# Altium schematic sheet 10 AM572x Interface 1.SchDoc
size 420 x 297 mm
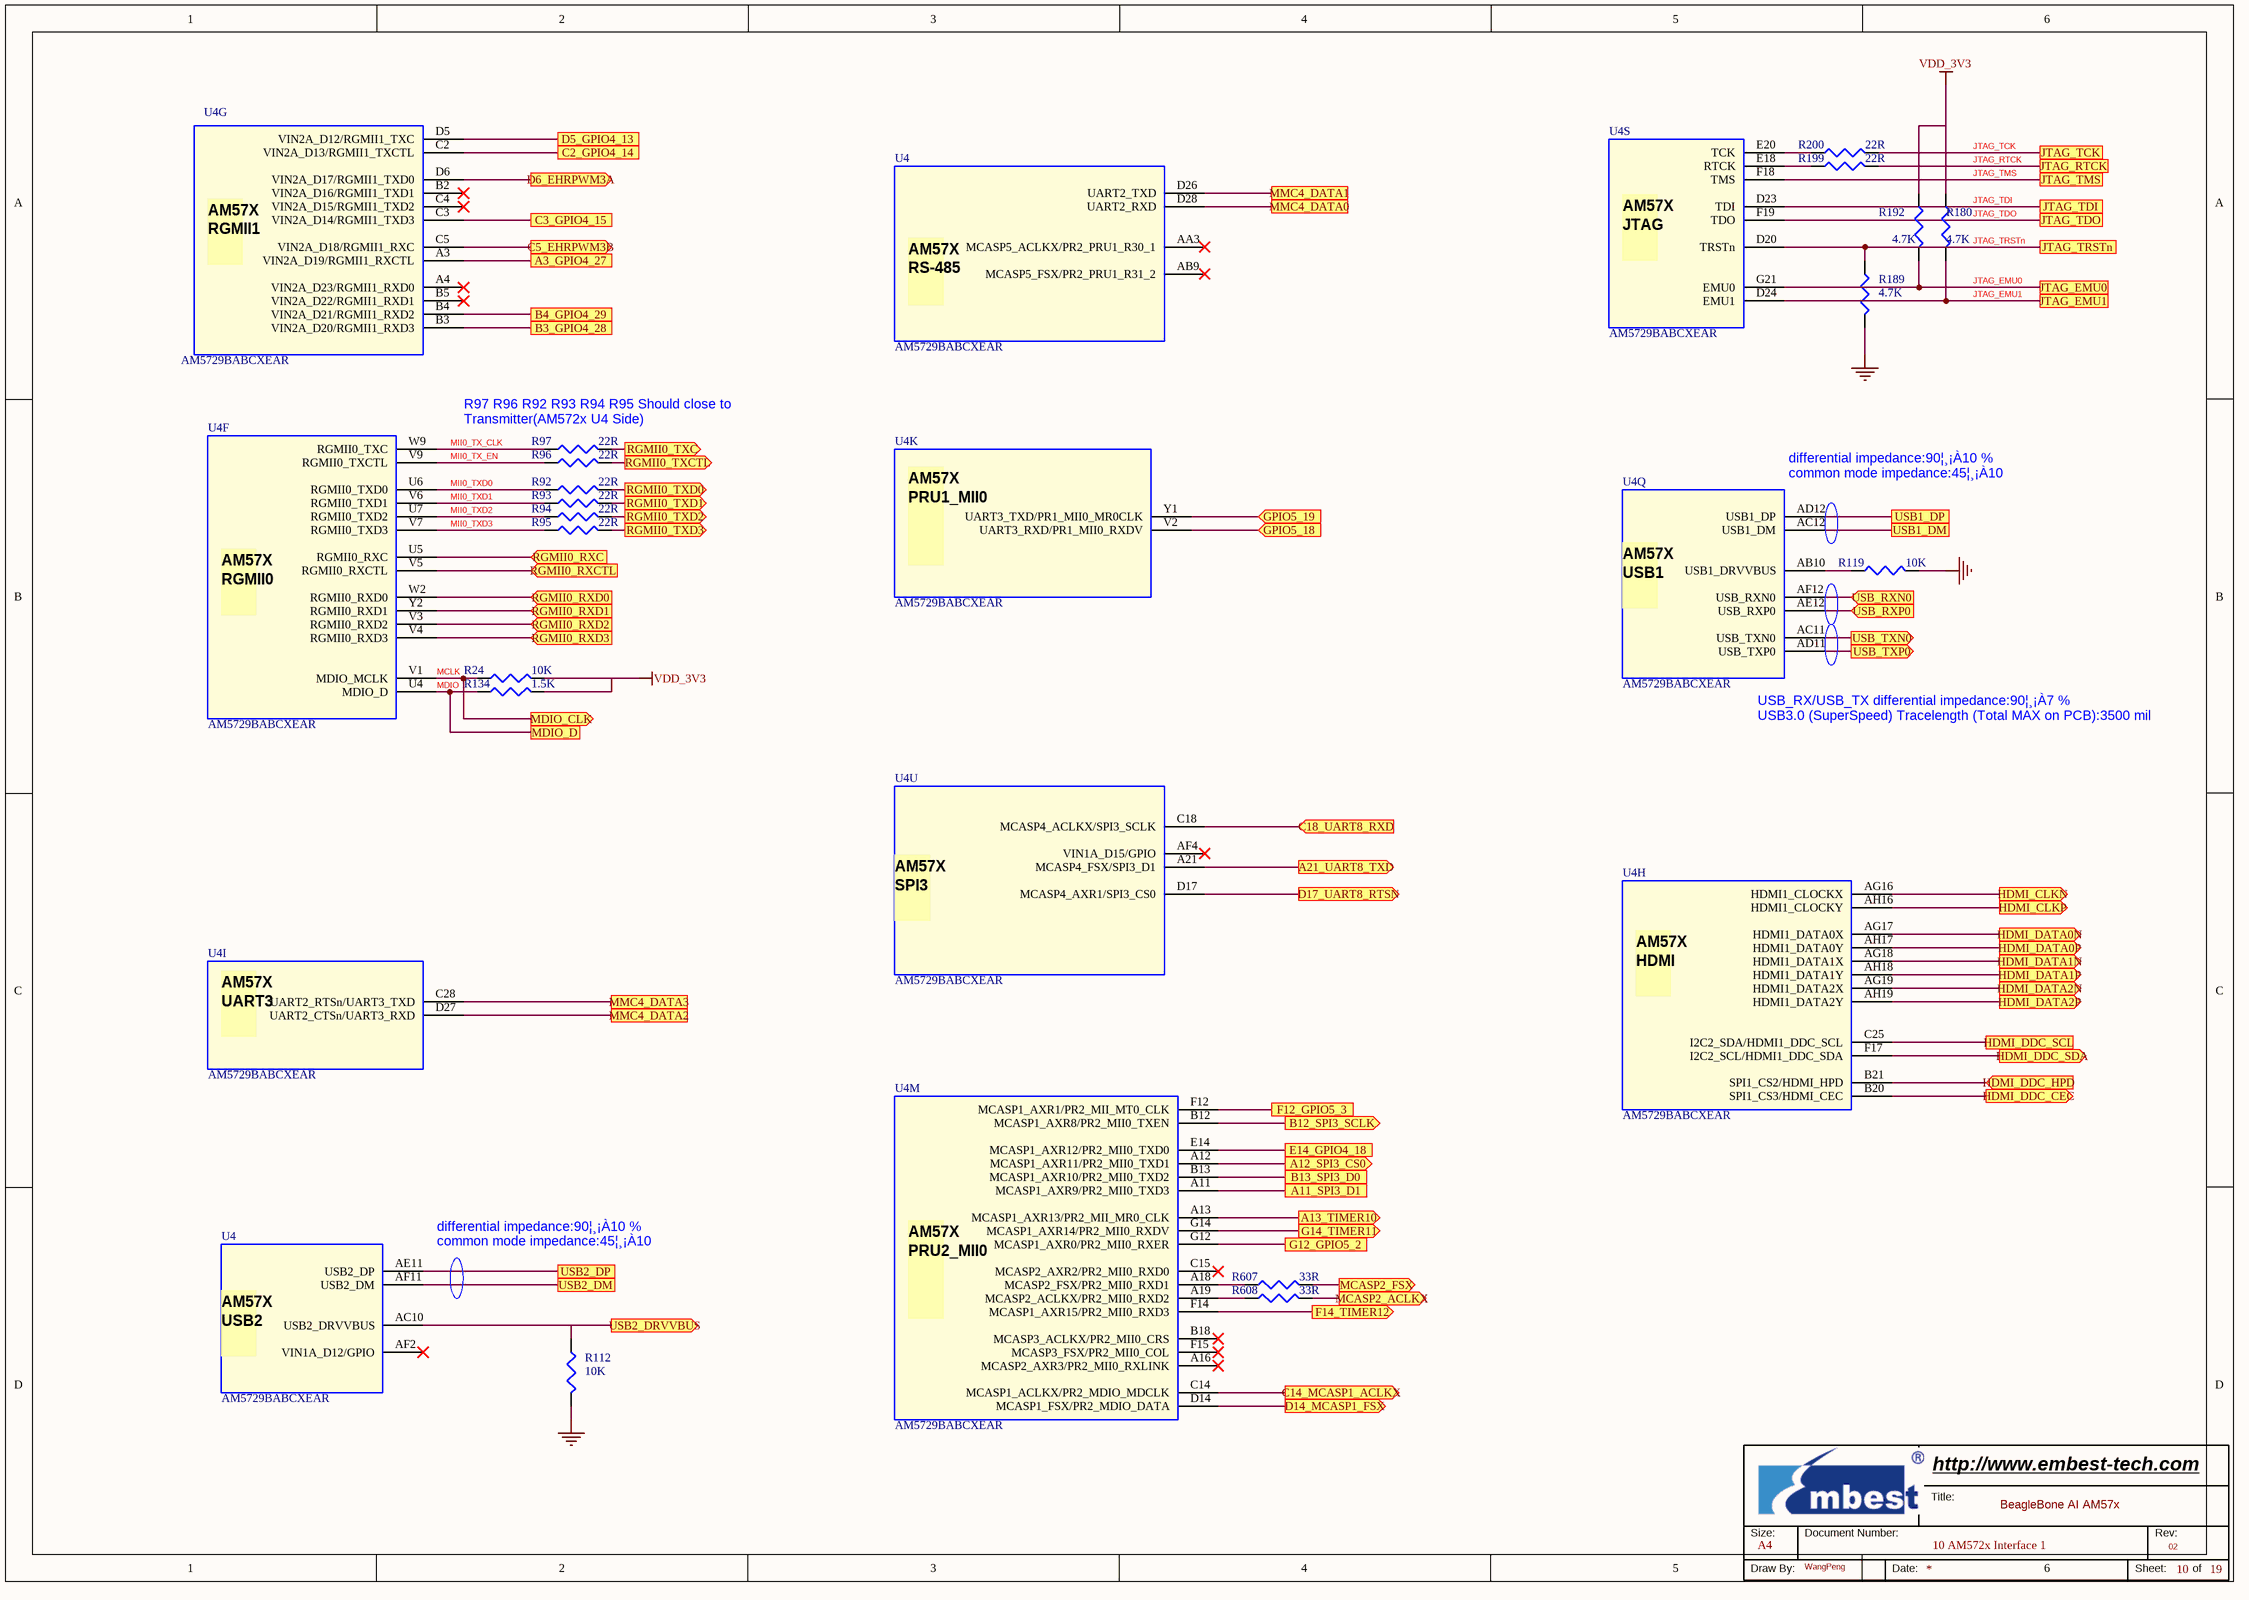
[diagram p0: 10 AM572x Interface 1.SchDoc]

## Parts
*  Page Count: 19  Page Number: 10  Page Size: A4  Title: BeagleBone AI AM57x  RevCode: 02  Doc: 10 AM572x Interface 1  Drawing: WangPeng  (hidden comment: Embest Title)  (graphical)
R24  10K  [R0402]
R92  22R  [R0402]
R93  22R  [R0402]
R94  22R  [R0402]
R95  22R  [R0402]
R96  22R  [R0402]
R97  22R  [R0402]
R112  10K  [R0402]
R119  10K  [R0402]
R134  1.5K  [R0402]
R180  4.7K  [R0402]
R189  4.7K  [R0402]
R192  4.7K  [R0402]
R199  22R  [R0402]
R200  22R  [R0402]
R607  33R  [R0402]
R608  33R  [R0402]
U4  AM5729BABCXEAR  [BGA23X23-760-117M]  (parts F,G,H,I,K,M,Q,S,U,27,29 of 29)

## Ports
A3_GPIO4_27, A11_SPI3_D1, A12_SPI3_CS0 (out), A13_TIMER10 (out), A21_UART8_TXD (out), B3_GPIO4_28, B4_GPIO4_29, B12_SPI3_SCLK (out), B13_SPI3_D0, C2_GPIO4_14, C3_GPIO4_15, C5_EHRPWM3B (out), C14_MCASP1_ACLKX (out), C18_UART8_RXD (in), D5_GPIO4_13, D6_EHRPWM3A (out), D14_MCASP1_FSX (out), D17_UART8_RTSN (out), E14_GPIO4_18, F12_GPIO5_3, F14_TIMER12 (out), G12_GPIO5_2, G14_TIMER11 (out), GPIO5_18 (in), GPIO5_19 (in), HDMI_CLKN (out), HDMI_CLKP (out), HDMI_DATA0N (out), HDMI_DATA0P (out), HDMI_DATA1N (out), HDMI_DATA1P (out), HDMI_DATA2N (out), HDMI_DATA2P (out), HDMI_DDC_CEC (out), HDMI_DDC_HPD (in), HDMI_DDC_SCL, HDMI_DDC_SDA (out), JTAG_EMU0, JTAG_EMU1, JTAG_RTCK, JTAG_TCK, JTAG_TDI, JTAG_TDO, JTAG_TMS, JTAG_TRSTn, MCASP2_ACLKX (out), MCASP2_FSX (out), MDIO_CLK (out), MDIO_D, MMC4_DATA0, MMC4_DATA1, MMC4_DATA2, MMC4_DATA3, RGMII0_RXC (in), RGMII0_RXCTL (in), RGMII0_RXD0 (in), RGMII0_RXD1 (in), RGMII0_RXD2 (in), RGMII0_RXD3 (in), RGMII0_TXC (out), RGMII0_TXCTL (out), RGMII0_TXD0 (out), RGMII0_TXD1 (out), RGMII0_TXD2 (out), RGMII0_TXD3 (out), USB1_DM, USB1_DP, USB2_DM, USB2_DP, USB2_DRVVBUS (out), USB_RXN0 (in), USB_RXP0 (in), USB_TXN0 (out), USB_TXP0 (out)

## Nets
GND: R112.2 R119.2 R189.2
VDD_3V3: R24.2 R134.2 R180.1 R192.1
A3_GPIO4_27: U4.A3(VIN2A_D19/RGMII1_RXCTL) ; port A3_GPIO4_27
A11_SPI3_D1: U4.A11(MCASP1_AXR9/PR2_MII0_TXD3) ; port A11_SPI3_D1
A12_SPI3_CS0: U4.A12(MCASP1_AXR11/PR2_MII0_TXD1) ; port A12_SPI3_CS0
A13_TIMER10: U4.A13(MCASP1_AXR13/PR2_MII_MR0_CLK) ; port A13_TIMER10
A21_UART8_TXD: U4.A21(MCASP4_FSX/SPI3_D1) ; port A21_UART8_TXD
B3_GPIO4_28: U4.B3(VIN2A_D20/RGMII1_RXD3) ; port B3_GPIO4_28
B4_GPIO4_29: U4.B4(VIN2A_D21/RGMII1_RXD2) ; port B4_GPIO4_29
B12_SPI3_SCLK: U4.B12(MCASP1_AXR8/PR2_MII0_TXEN) ; port B12_SPI3_SCLK
B13_SPI3_D0: U4.B13(MCASP1_AXR10/PR2_MII0_TXD2) ; port B13_SPI3_D0
C2_GPIO4_14: U4.C2(VIN2A_D13/RGMII1_TXCTL) ; port C2_GPIO4_14
C3_GPIO4_15: U4.C3(VIN2A_D14/RGMII1_TXD3) ; port C3_GPIO4_15
C5_EHRPWM3B: U4.C5(VIN2A_D18/RGMII1_RXC) ; port C5_EHRPWM3B
C14_MCASP1_ACLKX: U4.C14(MCASP1_ACLKX/PR2_MDIO_MDCLK) ; port C14_MCASP1_ACLKX
C18_UART8_RXD: U4.C18(MCASP4_ACLKX/SPI3_SCLK) ; port C18_UART8_RXD
D5_GPIO4_13: U4.D5(VIN2A_D12/RGMII1_TXC) ; port D5_GPIO4_13
D6_EHRPWM3A: U4.D6(VIN2A_D17/RGMII1_TXD0) ; port D6_EHRPWM3A
D14_MCASP1_FSX: U4.D14(MCASP1_FSX/PR2_MDIO_DATA) ; port D14_MCASP1_FSX
D17_UART8_RTSN: U4.D17(MCASP4_AXR1/SPI3_CS0) ; port D17_UART8_RTSN
E14_GPIO4_18: U4.E14(MCASP1_AXR12/PR2_MII0_TXD0) ; port E14_GPIO4_18
F12_GPIO5_3: U4.F12(MCASP1_AXR1/PR2_MII_MT0_CLK) ; port F12_GPIO5_3
F14_TIMER12: U4.F14(MCASP1_AXR15/PR2_MII0_RXD3) ; port F14_TIMER12
G12_GPIO5_2: U4.G12(MCASP1_AXR0/PR2_MII0_RXER) ; port G12_GPIO5_2
G14_TIMER11: U4.G14(MCASP1_AXR14/PR2_MII0_RXDV) ; port G14_TIMER11
GPIO5_18: U4.V2(UART3_RXD/PR1_MII0_RXDV) ; port GPIO5_18
GPIO5_19: U4.Y1(UART3_TXD/PR1_MII0_MR0CLK) ; port GPIO5_19
HDMI_CLKN: U4.AG16(HDMI1_CLOCKX) ; port HDMI_CLKN
HDMI_CLKP: U4.AH16(HDMI1_CLOCKY) ; port HDMI_CLKP
HDMI_DATA0N: U4.AG17(HDMI1_DATA0X) ; port HDMI_DATA0N
HDMI_DATA0P: U4.AH17(HDMI1_DATA0Y) ; port HDMI_DATA0P
HDMI_DATA1N: U4.AG18(HDMI1_DATA1X) ; port HDMI_DATA1N
HDMI_DATA1P: U4.AH18(HDMI1_DATA1Y) ; port HDMI_DATA1P
HDMI_DATA2N: U4.AG19(HDMI1_DATA2X) ; port HDMI_DATA2N
HDMI_DATA2P: U4.AH19(HDMI1_DATA2Y) ; port HDMI_DATA2P
HDMI_DDC_CEC: U4.B20(SPI1_CS3/HDMI_CEC) ; port HDMI_DDC_CEC
HDMI_DDC_HPD: U4.B21(SPI1_CS2/HDMI_HPD) ; port HDMI_DDC_HPD
HDMI_DDC_SCL: U4.C25(I2C2_SDA/HDMI1_DDC_SCL) ; port HDMI_DDC_SCL
HDMI_DDC_SDA: U4.F17(I2C2_SCL/HDMI1_DDC_SDA) ; port HDMI_DDC_SDA
JTAG_EMU0: R192.2 U4.G21(EMU0) ; port JTAG_EMU0
JTAG_EMU1: R180.2 U4.D24(EMU1) ; port JTAG_EMU1
JTAG_RTCK: R199.2 ; port JTAG_RTCK
JTAG_TCK: R200.2 ; port JTAG_TCK
JTAG_TDI: U4.D23(TDI) ; port JTAG_TDI
JTAG_TDO: U4.F19(TDO) ; port JTAG_TDO
JTAG_TMS: U4.F18(TMS) ; port JTAG_TMS
JTAG_TRSTn: R189.1 U4.D20(TRSTn) ; port JTAG_TRSTn
MCASP2_ACLKX: R608.2 ; port MCASP2_ACLKX
MCASP2_FSX: R607.2 ; port MCASP2_FSX
MCLK: R24.1 U4.V1(MDIO_MCLK) ; port MDIO_CLK
MDIO: R134.1 U4.U4(MDIO_D) ; port MDIO_D
MII0_TX_CLK: R97.1 U4.W9(RGMII0_TXC)
MII0_TX_EN: R96.1 U4.V9(RGMII0_TXCTL)
MII0_TXD0: R92.1 U4.U6(RGMII0_TXD0)
MII0_TXD1: R93.1 U4.V6(RGMII0_TXD1)
MII0_TXD2: R94.1 U4.U7(RGMII0_TXD2)
MII0_TXD3: R95.1 U4.V7(RGMII0_TXD3)
MMC4_DATA0: U4.D28(UART2_RXD) ; port MMC4_DATA0
MMC4_DATA1: U4.D26(UART2_TXD) ; port MMC4_DATA1
MMC4_DATA2: U4.D27(UART2_CTSn/UART3_RXD) ; port MMC4_DATA2
MMC4_DATA3: U4.C28(UART2_RTSn/UART3_TXD) ; port MMC4_DATA3
RGMII0_RXC: U4.U5(RGMII0_RXC) ; port RGMII0_RXC
RGMII0_RXCTL: U4.V5(RGMII0_RXCTL) ; port RGMII0_RXCTL
RGMII0_RXD0: U4.W2(RGMII0_RXD0) ; port RGMII0_RXD0
RGMII0_RXD1: U4.Y2(RGMII0_RXD1) ; port RGMII0_RXD1
RGMII0_RXD2: U4.V3(RGMII0_RXD2) ; port RGMII0_RXD2
RGMII0_RXD3: U4.V4(RGMII0_RXD3) ; port RGMII0_RXD3
RGMII0_TXC: R97.2 ; port RGMII0_TXC
RGMII0_TXCTL: R96.2 ; port RGMII0_TXCTL
RGMII0_TXD0: R92.2 ; port RGMII0_TXD0
RGMII0_TXD1: R93.2 ; port RGMII0_TXD1
RGMII0_TXD2: R94.2 ; port RGMII0_TXD2
RGMII0_TXD3: R95.2 ; port RGMII0_TXD3
USB1_DM: U4.AC12(USB1_DM) ; port USB1_DM
USB1_DP: U4.AD12(USB1_DP) ; port USB1_DP
USB2_DM: U4.AF11(USB2_DM) ; port USB2_DM
USB2_DP: U4.AE11(USB2_DP) ; port USB2_DP
USB2_DRVVBUS: R112.1 U4.AC10(USB2_DRVVBUS) ; port USB2_DRVVBUS
USB_RXN0: U4.AF12(USB_RXN0) ; port USB_RXN0
USB_RXP0: U4.AE12(USB_RXP0) ; port USB_RXP0
USB_TXN0: U4.AC11(USB_TXN0) ; port USB_TXN0
USB_TXP0: U4.AD11(USB_TXP0) ; port USB_TXP0
NetR119_1: R119.1 U4.AB10(USB1_DRVVBUS)
NetR199_1: R199.1 U4.E18(RTCK)
NetR200_1: R200.1 U4.E20(TCK)
NetR607_1: R607.1 U4.A18(MCASP2_FSX/PR2_MII0_RXD1)
NetR608_1: R608.1 U4.A19(MCASP2_ACLKX/PR2_MII0_RXD2)

Not connected (* = marked no-connect by the designer): U4 A4(VIN2A_D23/RGMII1_RXD0)* A16(MCASP2_AXR3/PR2_MII0_RXLINK)* AA3(MCASP5_ACLKX/PR2_PRU1_R30_1)* AB9(MCASP5_FSX/PR2_PRU1_R31_2)* AF2(VIN1A_D12/GPIO)* AF4(VIN1A_D15/GPIO)* B2(VIN2A_D16/RGMII1_TXD1)* B5(VIN2A_D22/RGMII1_RXD1)* B18(MCASP3_ACLKX/PR2_MII0_CRS)* C4(VIN2A_D15/RGMII1_TXD2)* C15(MCASP2_AXR2/PR2_MII0_RXD0)* F15(MCASP3_FSX/PR2_MII0_COL)*

## Notes on the sheet
- R97 R96 R92 R93 R94 R95 Should close to
  Transmitter(AM572x U4 Side)
- (near U4) differential impedance:90¦¸¡À10 %
  common mode impedance:45¦¸¡À10
- (near U4) USB_RX/USB_TX differential impedance:90¦¸¡À7 %
  USB3.0 (SuperSpeed) Tracelength (Total MAX on PCB):3500 mil
- differential impedance:90¦¸¡À10 %
  common mode impedance:45¦¸¡À10
- (in symbol AM57X, part F) AM57X / RGMII0 /
- (in symbol AM57X, part G) AM57X / RGMII1 /
- (in symbol AM57X, part H) AM57X / HDMI /
- (in symbol AM57X, part I) AM57X / UART3 /
- (in symbol AM57X, part K) AM57X / PRU1_MII0 /
- (in symbol AM57X, part M) AM57X / PRU2_MII0 /
- (in symbol AM57X, part Q) AM57X / USB1 /
- (in symbol AM57X, part S) AM57X / JTAG /
- (in symbol AM57X, part U) AM57X / SPI3 /
- (in symbol AM57X, part 27) AM57X / RS-485 /
- (in symbol AM57X, part 29) AM57X / USB2 /
- (in symbol Embest Title) Title:; Size:; Document Number:; Rev:; Draw By:; Date:; Sheet:; of

## Library data of the parts
R24 R119 = R: RES,10K,+/-5%,1/16W,SMD0402; Manufacturer Part Number: RC0402JR-0710KL; Manufacturer: YAGEO; Embest PN: 1003001100072; Part Type: Thick film Resistor
R92 R94 R97 = R: RES,22R,+/-5%,1/16W,SMD0402; Manufacturer: YAGEO; Manufacturer Part Number: RC0402JR-0722RL; Embest PN: 1003001100007; Part Type: Thick film Resistor
R93 R95 R96 R199 R200 = R: RES,22R,+/-5%,1/16W,SMD0402; Manufacturer Part Number: RC0402JR-0722RL; Manufacturer: YAGEO; Embest PN: 1003001100007; Part Type: Thick film Resistor
R112 = R: RES,10K,+/-5%,1/16W,SMD0402; Manufacturer: YAGEO; Manufacturer Part Number: RC0402JR-0710KL; Embest PN: 1003001100072; Part Type: Thick film Resistor
R134 = R: RES,1K5,+/-5%,1/16W,SMD0402; Manufacturer Part Number: RC0402JR-071K5L; Manufacturer: YAGEO; Embest PN: 1003001100038; Part Type: Thick film Resistor
R180 R189 = R: RES,4K7,+/-5%,1/16W,SMD0402; Manufacturer Part Number: RC0402JR-074K7L; Manufacturer: YAGEO; Embest PN: 1003001100057; Part Type: Thick film Resistor
R192 = R: RES,4K7,+/-5%,1/16W,SMD0402; Manufacturer: YAGEO; Manufacturer Part Number: RC0402JR-074K7L; Embest PN: 1003001100057; Part Type: Thick film Resistor
R607 R608 = R: RES,33R,+/-5%,1/16W,SMD0402; Manufacturer Part Number: RC0402JR-0733RL; Manufacturer: YAGEO; Embest PN: 1003001100010; Part Type: Thick film Resistor
U4 = AM57X: IC ARM Dual Cortex-A15 Microprocessor FCBGA(ABC)-760 SMD JEDEC TRAY; Vendor: TI; Embest PN: 1002001100053; Part Type: MPU; Manufacturer: TI; Manufacturer Part Number: AM5729BABCXEAR; Status: BeagleBone AI
* = Embest Title: Page Create Date: May 29, 2006; WebSite: http://www.embest-tech.com; Company: Embest; Page Modify Date: *